# Altium project CommandBoard.PrjPcb
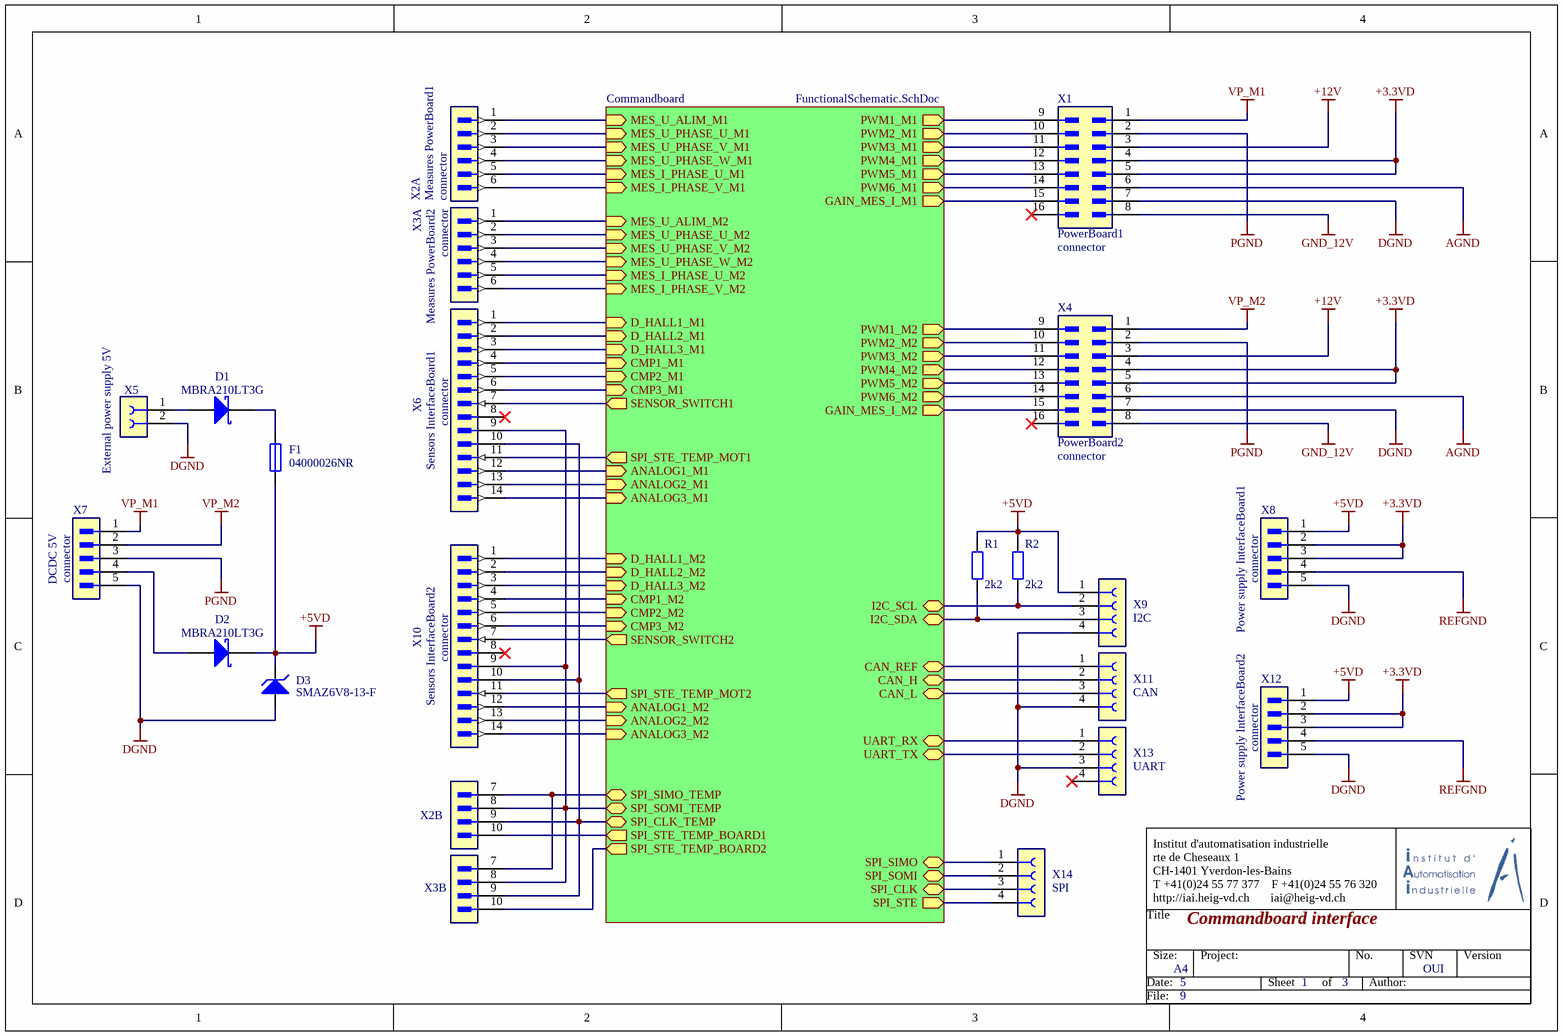
[diagram p0: CommandBoard.SchDoc]
ProjectAuthor: Bommottet Joan; ProjectiAiTitle: Driver Brushless; ProjectNumber: -; ProjectVersion: 1.0.0; ProjectVersionForDoc: 1_0_0
3 sheets, 127 parts. Net scope: hierarchical (ports join the sheet entries above them; power ports are global).
Board file: CommandBoard.PcbDoc
Sheets:
  CommandBoard.SchDoc
    Commandboard = FunctionalSchematic.SchDoc
      DSP = DSP.SchDoc

## Sheet CommandBoard.SchDoc: Commandboard interface
size A4; Author: Bommottet Joan; Organization: Institut d'Automatisation Industrielle; SheetNumber: 1; SheetTotal: 3; SVN: OUI; Version: 1.0.0; NoProject: -; ProjectTitle: Driver Brushless; CurrentTime: 6; CurrentDate: 5; DocumentFullPathAndName: 8; DocumentName: 9; ModifiedDate: 13; ProjectName: <projet>

### Parts
D1  value MBRA210LT3G  [DIOM4326X22N]  (hidden comment: DIODE SCHOTTKY 10V 2A SMA)
D2  value MBRA210LT3G  [DIOM4326X22N]  (hidden comment: DIODE SCHOTTKY 10V 2A SMA)
D3  value SMAZ6V8-13-F  [DIOM4326X22N]  (hidden comment: DIODE ZENER 6.8V 1W SMA)
F1  value 04000026NR  [FUSEC1508X06N]  (hidden comment: FUSE 1.5A 5V FAST 0603 SMD)
R1  value 2k2  [RESC1508X04N]  (hidden comment: RES SMD 2K2 0603)
R2  value 2k2  [RESC1508X04N]  (hidden comment: RES SMD 2K2 0603)
X1  Use: PowerBoard1  system: connector  [62101621021]  (hidden comment: CONNECT SMD 16pos 180°)
X2  Use: Measures PowerBoard1  system: connector  [62101021021]  (hidden comment: CONNECT SMD 10pos 180°)  (parts A,B of 2)
X3  Use: Measures PowerBoard2  system: connector  [62101021021]  (hidden comment: CONNECT SMD 10pos 180°)  (parts A,B of 2)
X4  Use: PowerBoard2  system: connector  [62101621021]  (hidden comment: CONNECT SMD 16pos 180°)
X5  Use: External power supply 5V  [WR-TBL322 3.81mm 2p]  (hidden comment: CONNECT 2pos 90°)
X6  Use: Sensors InterfaceBoard1  system: connector  [62101421021]  (hidden comment: CONNECT SMD 16pos 180°)
X7  Use: DCDC 5V  system: connector  [62000611121]  (hidden comment: CONNECT SMD 5pos 180°)
X8  Use: Power supply InterfaceBoard1  system: connector  [62000611121]  (hidden comment: CONNECT SMD 5pos 180°)
X9  Use: I2C  [TE_7-215079-4]  (hidden comment: CONNECT SMD 4pos 180°)
X10  Use: Sensors InterfaceBoard2  system: connector  [62101421021]  (hidden comment: CONNECT SMD 16pos 180°)
X11  Use: CAN  [TE_7-215079-4]  (hidden comment: CONNECT SMD 4pos 180°)
X12  Use: Power supply InterfaceBoard2  system: connector  [62000611121]  (hidden comment: CONNECT SMD 5pos 180°)
X13  Use: UART  [TE_7-215079-4]  (hidden comment: CONNECT SMD 4pos 180°)
X14  Use: SPI  [TE_7-215079-4]  (hidden comment: CONNECT SMD 4pos 180°)

### Sub-sheets
Commandboard = FunctionalSchematic.SchDoc: MES_I_PHASE_V_M1 (in), PWM4_M1 (out), MES_I_PHASE_U_M2 (in), ANALOG2_M2 (in), MES_U_PHASE_W_M1 (in), D_HALL3_M1 (in), PWM2_M1 (out), ANALOG2_M1 (in), UART_RX (bidir), PWM3_M1 (out), D_HALL2_M2 (in), SPI_SOMI (bidir), PWM4_M2 (out), PWM2_M2 (out), MES_U_ALIM_M1 (in), MES_I_PHASE_V_M2 (in), ANALOG3_M1 (in), D_HALL2_M1 (in), CAN_REF (bidir), MES_U_ALIM_M2 (in), PWM5_M2 (out), SPI_SIMO (bidir), PWM1_M2 (out), MES_I_PHASE_U_M1 (in), SPI_CLK (bidir), PWM3_M2 (out), PWM6_M2 (out), ANALOG1_M2 (in), PWM5_M1 (out), CAN_L (bidir), ANALOG3_M2 (in), I2C_SDA (bidir), PWM6_M1 (out), I2C_SCL (bidir), D_HALL3_M2 (in), PWM1_M1 (out), D_HALL1_M2 (in), UART_TX (bidir), CAN_H (bidir), ANALOG1_M1 (in), MES_U_PHASE_W_M2 (in), D_HALL1_M1 (in), SPI_SOMI_TEMP (bidir), SPI_CLK_TEMP (bidir), MES_U_PHASE_V_M1 (in), MES_U_PHASE_U_M1 (in), MES_U_PHASE_U_M2 (in), MES_U_PHASE_V_M2 (in), SPI_SIMO_TEMP (bidir), SENSOR_SWITCH1 (out), SENSOR_SWITCH2 (out), GAIN_MES_I_M1 (out), GAIN_MES_I_M2 (out), SPI_STE (out), CMP3_M1 (in), CMP1_M2 (in), SPI_STE_TEMP_BOARD1 (out), CMP1_M1 (in), SPI_STE_TEMP_MOT2 (out), SPI_STE_TEMP_MOT1 (out), CMP2_M1 (in), CMP3_M2 (in), CMP2_M2 (in), SPI_STE_TEMP_BOARD2 (out)

### Nets
+3.3VD: X1.4 X1.5 X4.4 X4.5 X8.2 X8.3 X12.2 X12.3
+5VD: D2.2(K) D3.2(K) F1.1 R1.2 R2.2 X8.1 X9.1 X12.1
+12V: X1.3 X4.3
AGND: X1.6 X4.6
DGND: D3.1(A) X1.7 X4.7 X5.2 X7.5 X8.5 X9.4 X11.4 X12.5 X13.3
GND_12V: X1.8 X4.8
PGND: X1.2 X4.2 X7.3
REFGND: X8.4 X12.4
VP_M1: X1.1 X7.1
VP_M2: X4.1 X7.2
NetD1_1: D1.1(A) X5.1
NetD1_2: D1.2(K) F1.2
NetD2_1: D2.1(A) X7.4
NetJP1_1: X11.2 ; sheet Commandboard/CAN_H
NetR1_1: R1.1 X9.3 ; sheet Commandboard/I2C_SDA
NetR2_1: R2.1 X9.2 ; sheet Commandboard/I2C_SCL
NetR9_1: X11.3 ; sheet Commandboard/CAN_L
NetR10_1: X2.1 ; sheet Commandboard/MES_U_ALIM_M1
NetR11_1: X2.4 ; sheet Commandboard/MES_U_PHASE_W_M1
NetR12_1: X6.12 ; sheet Commandboard/ANALOG1_M1
NetR13_1: X3.1 ; sheet Commandboard/MES_U_ALIM_M2
NetR14_1: X3.4 ; sheet Commandboard/MES_U_PHASE_W_M2
NetR15_1: X10.12 ; sheet Commandboard/ANALOG1_M2
NetR16_1: X2.2 ; sheet Commandboard/MES_U_PHASE_U_M1
NetR17_1: X2.5 ; sheet Commandboard/MES_I_PHASE_U_M1
NetR18_1: X6.13 ; sheet Commandboard/ANALOG2_M1
NetR19_1: X3.2 ; sheet Commandboard/MES_U_PHASE_U_M2
NetR20_1: X3.5 ; sheet Commandboard/MES_I_PHASE_U_M2
NetR21_1: X10.13 ; sheet Commandboard/ANALOG2_M2
NetR22_1: X2.3 ; sheet Commandboard/MES_U_PHASE_V_M1
NetR23_1: X2.6 ; sheet Commandboard/MES_I_PHASE_V_M1
NetR24_1: X6.14 ; sheet Commandboard/ANALOG3_M1
NetR25_1: X3.3 ; sheet Commandboard/MES_U_PHASE_V_M2
NetR26_1: X3.6 ; sheet Commandboard/MES_I_PHASE_V_M2
NetR27_1: X10.14 ; sheet Commandboard/ANALOG3_M2
NetU4_5: X11.1 ; sheet Commandboard/CAN_REF
NetU6_4: X1.9 ; sheet Commandboard/PWM1_M1
NetU6_5: X1.10 ; sheet Commandboard/PWM2_M1
NetU6_6: X1.11 ; sheet Commandboard/PWM3_M1
NetU6_7: X1.12 ; sheet Commandboard/PWM4_M1
NetU6_8: X1.13 ; sheet Commandboard/PWM5_M1
NetU6_9: X1.14 ; sheet Commandboard/PWM6_M1
NetU6_12: X6.1 ; sheet Commandboard/D_HALL1_M1
NetU6_13: X6.2 ; sheet Commandboard/D_HALL2_M1
NetU6_14: X6.3 ; sheet Commandboard/D_HALL3_M1
NetU6_22: X2.10 ; sheet Commandboard/SPI_STE_TEMP_BOARD1
NetU6_23: X6.11 ; sheet Commandboard/SPI_STE_TEMP_MOT1
NetU6_24: X3.10 ; sheet Commandboard/SPI_STE_TEMP_BOARD2
NetU6_25: X10.11 ; sheet Commandboard/SPI_STE_TEMP_MOT2
NetU6_63: X2.7 X3.7 ; sheet Commandboard/SPI_SIMO_TEMP
NetU6_64: X1.15 ; sheet Commandboard/GAIN_MES_I_M1
NetU6_65: X4.15 ; sheet Commandboard/GAIN_MES_I_M2
NetU6_97: X14.4 ; sheet Commandboard/SPI_STE
NetU6_101: X6.7 ; sheet Commandboard/SENSOR_SWITCH1
NetU6_102: X10.7 ; sheet Commandboard/SENSOR_SWITCH2
NetU6_108: X10.4 ; sheet Commandboard/CMP1_M2
NetU6_109: X10.5 ; sheet Commandboard/CMP2_M2
NetU6_111: X10.6 ; sheet Commandboard/CMP3_M2
NetU6_134: X14.1 ; sheet Commandboard/SPI_SIMO
NetU6_135: X14.2 ; sheet Commandboard/SPI_SOMI
NetU6_136: X14.3 ; sheet Commandboard/SPI_CLK
NetU6_141: X10.1 ; sheet Commandboard/D_HALL1_M2
NetU6_142: X10.2 ; sheet Commandboard/D_HALL2_M2
NetU6_143: X10.3 ; sheet Commandboard/D_HALL3_M2
NetU6_145: X6.4 ; sheet Commandboard/CMP1_M1
NetU6_146: X6.5 ; sheet Commandboard/CMP2_M1
NetU6_149: X6.6 ; sheet Commandboard/CMP3_M1
NetU6_154: X13.2 ; sheet Commandboard/UART_TX
NetU6_155: X13.1 ; sheet Commandboard/UART_RX
NetU6_160: X4.9 ; sheet Commandboard/PWM1_M2
NetU6_161: X4.10 ; sheet Commandboard/PWM2_M2
NetU6_162: X4.11 ; sheet Commandboard/PWM3_M2
NetU6_163: X4.12 ; sheet Commandboard/PWM4_M2
NetU6_164: X4.13 ; sheet Commandboard/PWM5_M2
NetU6_165: X4.14 ; sheet Commandboard/PWM6_M2
NetU6_174: X2.8 X3.8 X6.9 X10.9 ; sheet Commandboard/SPI_SOMI_TEMP
NetU6_175: X2.9 X3.9 X6.10 X10.10 ; sheet Commandboard/SPI_CLK_TEMP

Not connected (* = marked no-connect by the designer): X1 16*; X4 16*; X6 8*; X10 8*; X13 4*

### Notes on the sheet
- Title
- Institut d'automatisation industrielle
  rte de Cheseaux 1
  CH-1401 Yverdon-les-Bains
  T +41(0)24 55 77 377    F +41(0)24 55 76 320
  http://iai.heig-vd.ch       iai@heig-vd.ch
- Date:
- Size:
- A4
- Project:
- Sheet
- of
- No.
- Author:
- SVN
- Version
- File:

### Library data of the parts
D1 D2 = DIODE SCHOTTKY 10V 2A SMA: Diode Schottky 10V 2A Montage en surface SMA; ComponentLink1Description: Manufacturer Link; ComponentLink1URL: http://www.infineon.com/; ComponentLink2Description: Datasheet; ComponentLink2URL: http://www.infineon.com/upload/Document/cmc_upload/documents/009/363/bat17series.pdf; Supplier 1: Digi-Key; Supplier Part Number 1: MBRA210LT3GOSCT-ND
D3 = DIODE ZENER 6.8V 1W SMA: Diodes - Zener 6,8V 1W ±5% Montage en surface SMA; Supplier 1: Digi-Key; Supplier Part Number 1: SMAZ6V8-FDICT-ND
F1 = FUSE 1.5A 5V FAST 0603 SMD: 1,5A CA 5V Fusible CC Montage sur carte (type cartouche exclu) Montage en surface 0603 (1608 métrique); Supplier 1: Digi-Key; Supplier Part Number 1: F12132CT-ND
R1 R2 = RES SMD 2K2 OHM 1% 1/10W 0603: 2,2 kOhms ±1% 0,1W, 1/10W Pavé résistif 0603 (1608 métrique) AutomobileAEC-Q200 Couche épaisse; Supplier 1: Digi-Key; Supplier Part Number 1: RMCF0603FT2K20CT-ND
X1 X4 = CONNECT SMD 16pos 2row 180° 1.27mm: Value: *
X2 X3 = CONNECT SMD 10pos 180° 1.27mm: Value: *
X5 = CONNECT 2pos 90° 3.81mm F: 2 Positions, bloc de jonction Embase, broche mâle, gainée (4 côtés) 0,150 po (3,81mm) 90°, engle droit Trou traversant; Value: WR-TBL322; Supplier 1: Digi-Key; Supplier Part Number 1: 732-2088-ND
X6 X10 = CONNECT SMD 16pos 180° 1.27mm: Value: *
X7 X8 X12 = CONNECT SMD 5pos 180° 2mm: Value: *
X9 X11 X13 X14 = CONNECT SMD 4pos 180° 2.54mm F: Connecteur, embase Montage en surface 4 positions 0,100 po (2,54mm); Value: *

## Sheet FunctionalSchematic.SchDoc: DSP
size A3; Author: Bommottet Joan; Organization: Institut d'Automatisation Industrielle; SheetNumber: 2; SheetTotal: 3; SVN: OUI; Version: 1.0.0; NoProject: -; ProjectTitle: Driver Brushless; CurrentTime: 6; CurrentDate: 5; DocumentFullPathAndName: 8; DocumentName: 9; ModifiedDate: 13; ProjectName: <projet>
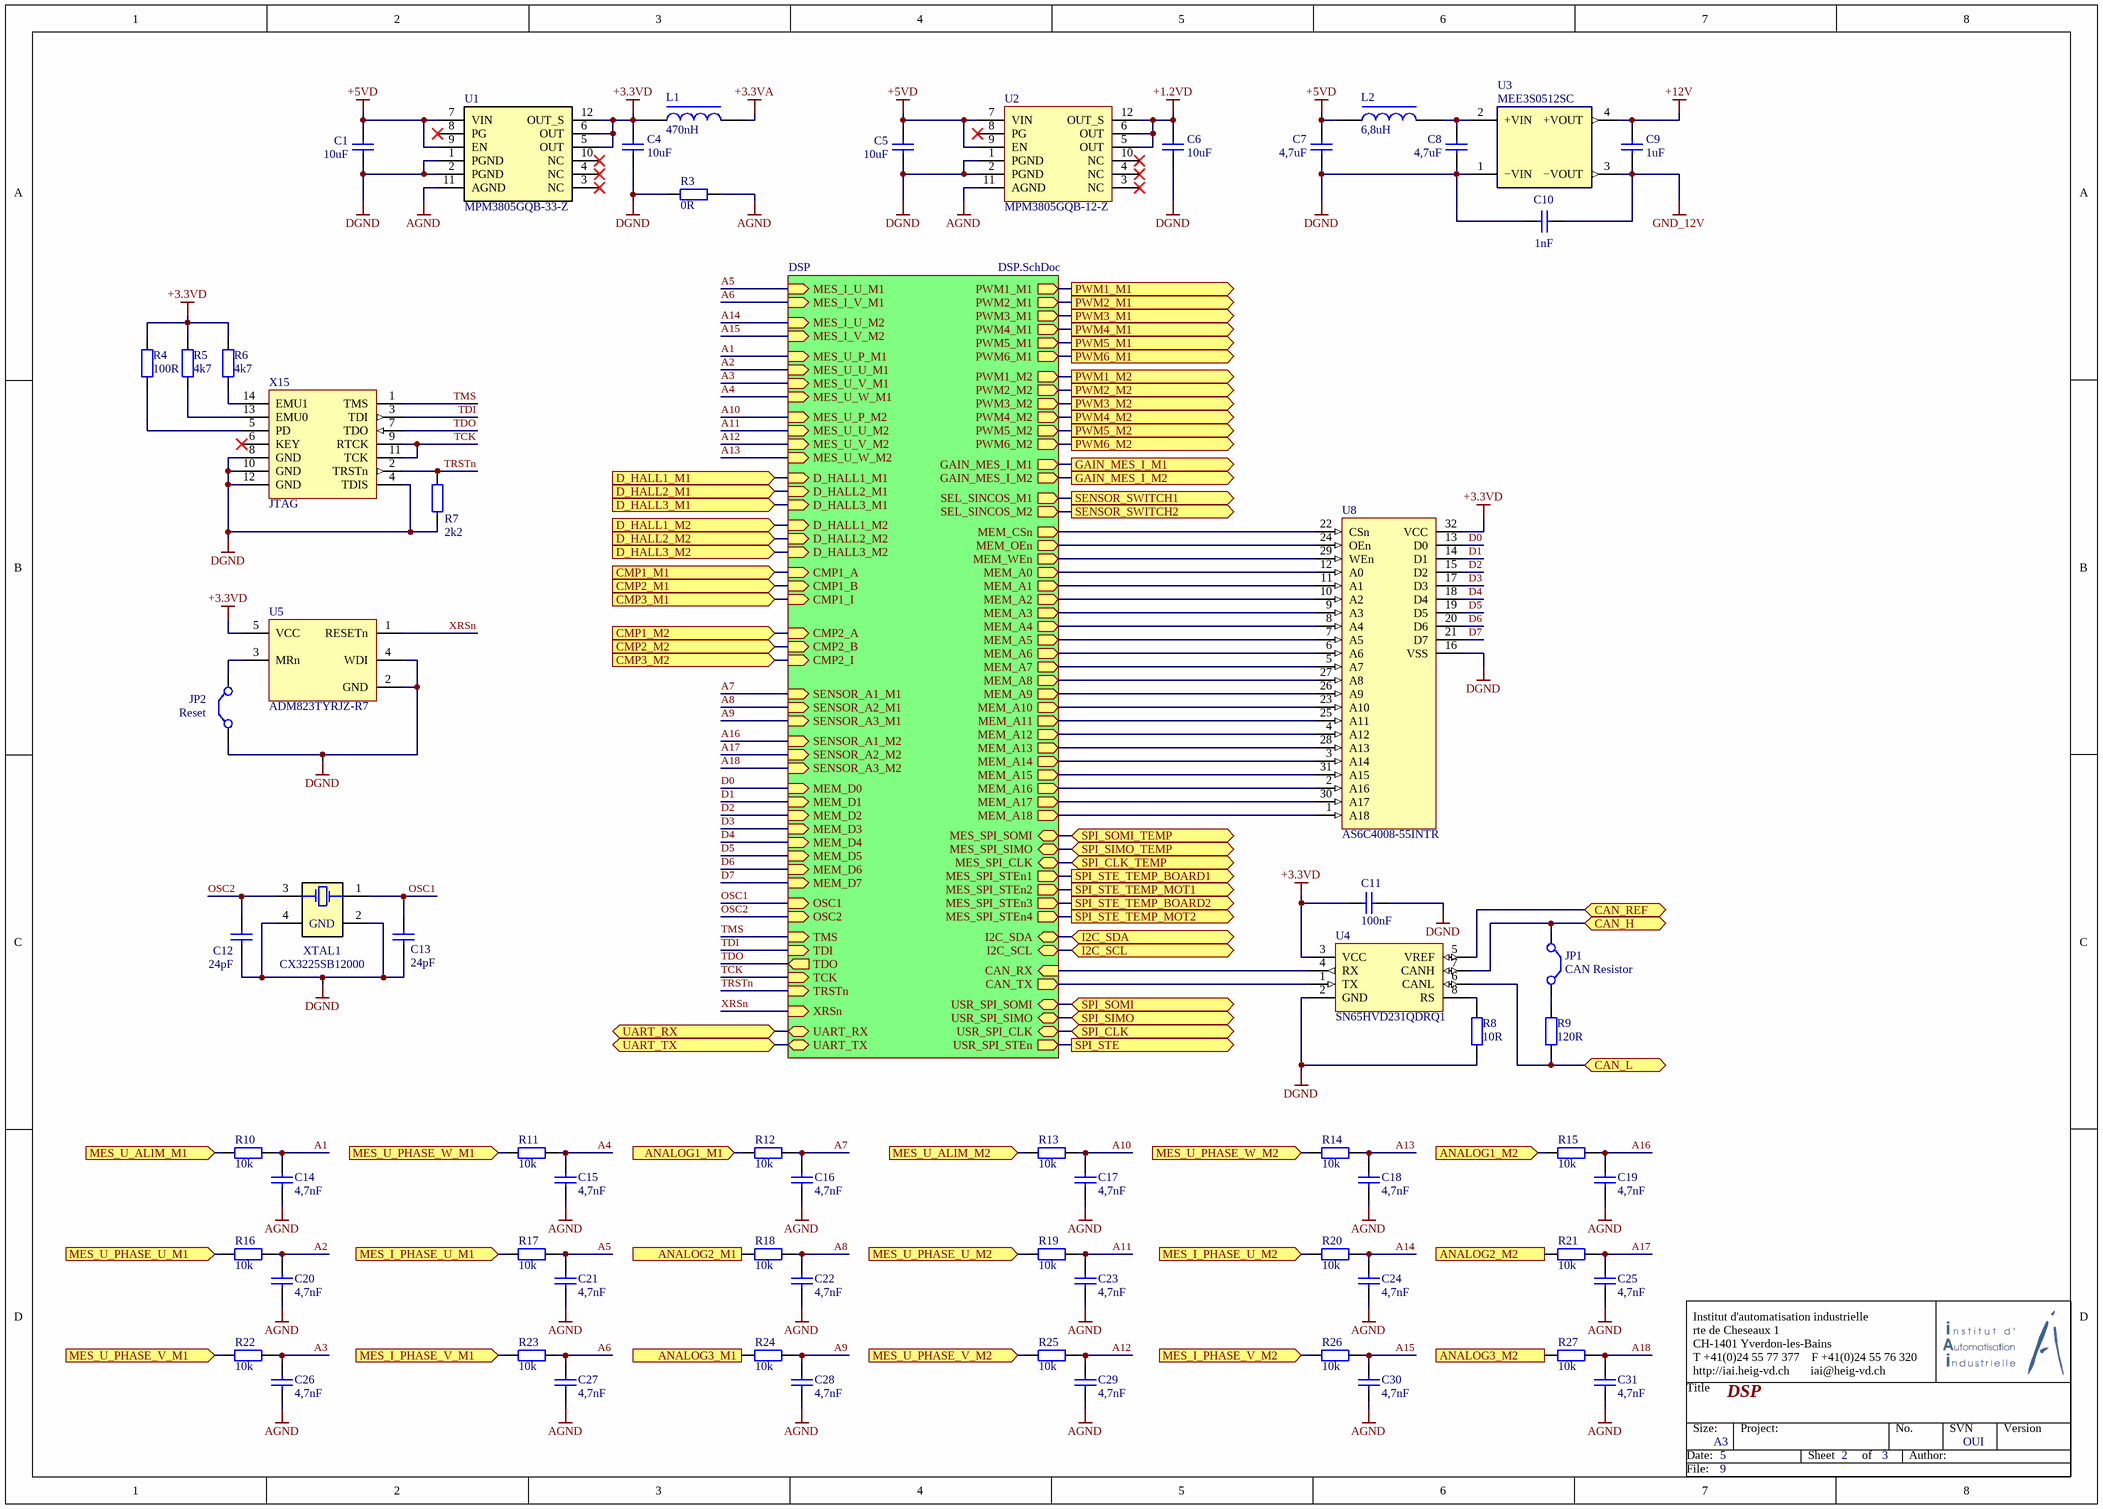
[diagram p1: FunctionalSchematic.SchDoc]

### Parts
C1  value 10uF  [CAPC1608X08N]  (hidden comment: CAP CER 10uF 0603)
C4  value 10uF  [CAPC1608X08N]  (hidden comment: CAP CER 10uF 0603)
C5  value 10uF  [CAPC1608X08N]  (hidden comment: CAP CER 10uF 0603)
C6  value 10uF  [CAPC1608X08N]  (hidden comment: CAP CER 10uF 0603)
C7  value 4,7uF  [CAPC1608X08N]  (hidden comment: CAP CER 4.7uF 0603)
C8  value 4,7uF  [CAPC1608X08N]  (hidden comment: CAP CER 4.7uF 0603)
C9  value 1uF  [CAPC1608X08N]  (hidden comment: CAP CER 1uF 0603)
C10  value 1nF  [CAPC1608X08N]  (hidden comment: CAP CER 1nF 0603)
C11  value 100nF  [CAPC1608X08N]  (hidden comment: CAP CER 100nF 0603)
C12  value 24pF  [CAPC1608X08N]  (hidden comment: CAP CER 1nF 0603)
C13  value 24pF  [CAPC1608X08N]  (hidden comment: CAP CER 1nF 0603)
C14  value 4,7nF  [CAPC1608X08N]  (hidden comment: CAP CER 4.7nF 0603)
C15  value 4,7nF  [CAPC1608X08N]  (hidden comment: CAP CER 4.7nF 0603)
C16  value 4,7nF  [CAPC1608X08N]  (hidden comment: CAP CER 4.7nF 0603)
C17  value 4,7nF  [CAPC1608X08N]  (hidden comment: CAP CER 4.7nF 0603)
C18  value 4,7nF  [CAPC1608X08N]  (hidden comment: CAP CER 4.7nF 0603)
C19  value 4,7nF  [CAPC1608X08N]  (hidden comment: CAP CER 4.7nF 0603)
C20  value 4,7nF  [CAPC1608X08N]  (hidden comment: CAP CER 4.7nF 0603)
C21  value 4,7nF  [CAPC1608X08N]  (hidden comment: CAP CER 4.7nF 0603)
C22  value 4,7nF  [CAPC1608X08N]  (hidden comment: CAP CER 4.7nF 0603)
C23  value 4,7nF  [CAPC1608X08N]  (hidden comment: CAP CER 4.7nF 0603)
C24  value 4,7nF  [CAPC1608X08N]  (hidden comment: CAP CER 4.7nF 0603)
C25  value 4,7nF  [CAPC1608X08N]  (hidden comment: CAP CER 4.7nF 0603)
C26  value 4,7nF  [CAPC1608X08N]  (hidden comment: CAP CER 4.7nF 0603)
C27  value 4,7nF  [CAPC1608X08N]  (hidden comment: CAP CER 4.7nF 0603)
C28  value 4,7nF  [CAPC1608X08N]  (hidden comment: CAP CER 4.7nF 0603)
C29  value 4,7nF  [CAPC1608X08N]  (hidden comment: CAP CER 4.7nF 0603)
C30  value 4,7nF  [CAPC1608X08N]  (hidden comment: CAP CER 4.7nF 0603)
C31  value 4,7nF  [CAPC1608X08N]  (hidden comment: CAP CER 4.7nF 0603)
JP1  Use: CAN Resistor  [62000211121]  (hidden comment: CONNECT 2pos 90°)
JP2  Use: Reset  [62000211121]  (hidden comment: CONNECT 2pos 90°)
L1  value 470nH  [INDC2016X10N]  (hidden comment: IND SMD 470nH 0806)
L2  value 6,8uH  [INDC1608X10N]  (hidden comment: IND SMD 0603)
R3  value 0R  [RESC1508X04N]  (hidden comment: RES SMD 0R 0603)
R4  value 100R  [RESC1508X04N]  (hidden comment: RES SMD 100R 0603)
R5  value 4k7  [RESC1508X04N]  (hidden comment: RES SMD 4.7k 0603)
R6  value 4k7  [RESC1508X04N]  (hidden comment: RES SMD 4.7k 0603)
R7  value 2k2  [RESC1508X04N]  (hidden comment: RES SMD 2K2 0603)
R8  value 10R  [RESC1508X04N]  (hidden comment: RES SMD 10R 0603)
R9  value 120R  [RESC1508X04N]  (hidden comment: RES SMD 120R 0603)
R10  value 10k  [RESC1508X04N]  (hidden comment: RES 10K SMD 0603)
R11  value 10k  [RESC1508X04N]  (hidden comment: RES 10K SMD 0603)
R12  value 10k  [RESC1508X04N]  (hidden comment: RES 10K SMD 0603)
R13  value 10k  [RESC1508X04N]  (hidden comment: RES 10K SMD 0603)
R14  value 10k  [RESC1508X04N]  (hidden comment: RES 10K SMD 0603)
R15  value 10k  [RESC1508X04N]  (hidden comment: RES 10K SMD 0603)
R16  value 10k  [RESC1508X04N]  (hidden comment: RES 10K SMD 0603)
R17  value 10k  [RESC1508X04N]  (hidden comment: RES 10K SMD 0603)
R18  value 10k  [RESC1508X04N]  (hidden comment: RES 10K SMD 0603)
R19  value 10k  [RESC1508X04N]  (hidden comment: RES 10K SMD 0603)
R20  value 10k  [RESC1508X04N]  (hidden comment: RES 10K SMD 0603)
R21  value 10k  [RESC1508X04N]  (hidden comment: RES 10K SMD 0603)
R22  value 10k  [RESC1508X04N]  (hidden comment: RES 10K SMD 0603)
R23  value 10k  [RESC1508X04N]  (hidden comment: RES 10K SMD 0603)
R24  value 10k  [RESC1508X04N]  (hidden comment: RES 10K SMD 0603)
R25  value 10k  [RESC1508X04N]  (hidden comment: RES 10K SMD 0603)
R26  value 10k  [RESC1508X04N]  (hidden comment: RES 10K SMD 0603)
R27  value 10k  [RESC1508X04N]  (hidden comment: RES 10K SMD 0603)
U1  value MPM3805GQB-33-Z  [QFN2p5x3p0x0p9_MNP]  (hidden comment: DC DC CONVERTER 5V-3.3V)
U2  value MPM3805GQB-12-Z  [QFN2p5x3p0x0p9_MNP]  (hidden comment: DC DC CONVERTER 5V-1.2V)
U3  value MEE3S0512SC  [DCDC CONVERTER]  (hidden comment: DC DC CONVERTER 5V-12V)
U4  value SN65HVD231QDRQ1  [SOIC127P600X175-8N]  (hidden comment: IC TRANSCEIVER CAN)
U5  value ADM823TYRJZ-R7  [SOT95P280X145-5N]  (hidden comment: SUPERVISOR 1 CHANNEL)
U8  value AS6C4008-55INTR  [SOP127P1410X300-32N]  (hidden comment: RAM SPI)
X15  Use: JTAG  [62101421021]  (hidden comment: CONNECT SMD 7x2pos 180°)
XTAL1  value CX3225SB12000  [OSCCC320X250X60N]  (hidden comment: CRYSTAL 12.0000MHZ)

### Sub-sheets
DSP = DSP.SchDoc: MEM_A11 (out), MES_U_U_M2 (in), MEM_A18 (out), SEL_SINCOS_M2 (out), MES_U_P_M2 (in), MEM_D1 (in), SENSOR_A3_M1 (in), D_HALL3_M1 (in), D_HALL3_M2 (in), MES_SPI_STEn1 (out), SENSOR_A3_M2 (in), MES_SPI_STEn3 (out), MES_I_U_M2 (in), MEM_D0 (in), CMP1_I (in), MEM_D4 (in), CMP2_I (in), MES_SPI_STEn2 (out), CMP2_B (in), MEM_D5 (in), MEM_D6 (in), MES_SPI_STEn4 (out), MEM_A15 (out), CMP1_A (in), MES_I_V_M1 (in), MEM_D2 (in), OSC2 (in), TDI (in), SEL_SINCOS_M1 (out), MES_U_P_M1 (in), SENSOR_A2_M1 (in), XRSn (in), SENSOR_A1_M1 (in), SENSOR_A2_M2 (in), MEM_D7 (in), MES_U_V_M2 (in), D_HALL2_M2 (in), MEM_A16 (out), OSC1 (in), MES_I_V_M2 (in), MEM_A7 (out), MEM_A14 (out), MEM_D3 (in), MEM_A10 (out), MEM_A9 (out), TMS (in), MES_U_V_M1 (in), GAIN_MES_I_M1 (out), MEM_A12 (out), TRSTn (in), D_HALL1_M1 (in), MEM_A6 (out), MEM_A17 (out), CMP1_B (in), MES_U_W_M1 (in), SENSOR_A1_M2 (in), MES_U_U_M1 (in), D_HALL2_M1 (in), TCK (in), D_HALL1_M2 (in), MES_U_W_M2 (in), MEM_A13 (out), TDO (out), MES_I_U_M1 (in), MEM_CSn (out), MEM_A8 (out), CMP2_A (in), GAIN_MES_I_M2 (out), MEM_A2 (out), PWM5_M1 (out), MEM_A0 (out), PWM6_M1 (out), MEM_OEn (out), MES_SPI_CLK (bidir), USR_SPI_CLK (bidir), PWM2_M1 (out), PWM5_M2 (out), UART_TX (bidir), MES_SPI_SOMI (bidir), PWM6_M2 (out), PWM1_M2 (out), USR_SPI_SIMO (bidir), PWM3_M1 (out), I2C_SCL (bidir), USR_SPI_SOMI (bidir), MEM_A5 (out), PWM3_M2 (out), I2C_SDA (bidir), MEM_A4 (out), MEM_WEn (out), UART_RX (bidir), PWM4_M2 (out), CAN_RX (in), USR_SPI_STEn (out), CAN_TX (out), PWM4_M1 (out), PWM1_M1 (out), MES_SPI_SIMO (bidir), MEM_A3 (out), MEM_A1 (out), PWM2_M2 (out)

### Ports
ANALOG1_M1 (in), ANALOG1_M2 (in), ANALOG2_M1 (in), ANALOG2_M2 (in), ANALOG3_M1 (in), ANALOG3_M2 (in), CAN_H (bidir), CAN_L (bidir), CAN_REF (bidir), CMP1_M1 (in), CMP1_M2 (in), CMP2_M1 (in), CMP2_M2 (in), CMP3_M1 (in), CMP3_M2 (in), D_HALL1_M1 (in), D_HALL1_M2 (in), D_HALL2_M1 (in), D_HALL2_M2 (in), D_HALL3_M1 (in), D_HALL3_M2 (in), GAIN_MES_I_M1 (out), GAIN_MES_I_M2 (out), I2C_SCL (bidir), I2C_SDA (bidir), MES_I_PHASE_U_M1 (in), MES_I_PHASE_U_M2 (in), MES_I_PHASE_V_M1 (in), MES_I_PHASE_V_M2 (in), MES_U_ALIM_M1 (in), MES_U_ALIM_M2 (in), MES_U_PHASE_U_M1 (in), MES_U_PHASE_U_M2 (in), MES_U_PHASE_V_M1 (in), MES_U_PHASE_V_M2 (in), MES_U_PHASE_W_M1 (in), MES_U_PHASE_W_M2 (in), PWM1_M1 (out), PWM1_M2 (out), PWM2_M1 (out), PWM2_M2 (out), PWM3_M1 (out), PWM3_M2 (out), PWM4_M1 (out), PWM4_M2 (out), PWM5_M1 (out), PWM5_M2 (out), PWM6_M1 (out), PWM6_M2 (out), SENSOR_SWITCH1 (out), SENSOR_SWITCH2 (out), SPI_CLK (bidir), SPI_CLK_TEMP (bidir), SPI_SIMO (bidir), SPI_SIMO_TEMP (bidir), SPI_SOMI (bidir), SPI_SOMI_TEMP (bidir), SPI_STE (out), SPI_STE_TEMP_BOARD1 (out), SPI_STE_TEMP_BOARD2 (out), SPI_STE_TEMP_MOT1 (out), SPI_STE_TEMP_MOT2 (out), UART_RX (bidir), UART_TX (bidir)

### Nets
+1.2VD: C6.2 U2.5(OUT) U2.6(OUT) U2.12(OUT_S)
+3.3VA: L1.2
+3.3VD: C4.2 C11.1 L1.1 R4.2 R5.2 R6.2 U1.5(OUT) U1.6(OUT) U1.12(OUT_S) U4.3(VCC) U5.5(VCC) U8.32(VCC)
+5VD: C1.2 C5.2 C7.2 L2.1 U1.7(VIN) U1.9(EN) U2.7(VIN) U2.9(EN)
+12V: C9.2 U3.4(+VOUT)
AGND: C14.1 C15.1 C16.1 C17.1 C18.1 C19.1 C20.1 C21.1 C22.1 C23.1 C24.1 C25.1 C26.1 C27.1 C28.1 C29.1 C30.1 C31.1 R3.2 U1.11(AGND) U2.11(AGND)
DGND: C1.1 C4.1 C5.1 C6.1 C7.1 C8.1 C10.1 C11.2 C12.1 C13.2 JP2.2(C2) R3.1 R7.1 R8.1 U1.1(PGND) U1.2(PGND) U2.1(PGND) U2.2(PGND) U3.1(−VIN) U4.2(GND) U5.2(GND) U5.4(WDI) U8.16(VSS) X15.4(TDIS) X15.8(GND) X15.10(GND) X15.12(GND) XTAL1.2(GND) XTAL1.4(GND)
GND_12V: C9.1 C10.2 U3.3(−VOUT)
A1: C14.2 R10.2 ; sheet DSP/MES_U_P_M1
A2: C20.2 R16.2 ; sheet DSP/MES_U_U_M1
A3: C26.2 R22.2 ; sheet DSP/MES_U_V_M1
A4: C15.2 R11.2 ; sheet DSP/MES_U_W_M1
A5: C21.2 R17.2 ; sheet DSP/MES_I_U_M1
A6: C27.2 R23.2 ; sheet DSP/MES_I_V_M1
A7: C16.2 R12.2 ; sheet DSP/SENSOR_A1_M1
A8: C22.2 R18.2 ; sheet DSP/SENSOR_A2_M1
A9: C28.2 R24.2 ; sheet DSP/SENSOR_A3_M1
A10: C17.2 R13.2 ; sheet DSP/MES_U_P_M2
A11: C23.2 R19.2 ; sheet DSP/MES_U_U_M2
A12: C29.2 R25.2 ; sheet DSP/MES_U_V_M2
A13: C18.2 R14.2 ; sheet DSP/MES_U_W_M2
A14: C24.2 R20.2 ; sheet DSP/MES_I_U_M2
A15: C30.2 R26.2 ; sheet DSP/MES_I_V_M2
A16: C19.2 R15.2 ; sheet DSP/SENSOR_A1_M2
A17: C25.2 R21.2 ; sheet DSP/SENSOR_A2_M2
A18: C31.2 R27.2 ; sheet DSP/SENSOR_A3_M2
D0: U8.13(D0) ; sheet DSP/MEM_D0
D1: U8.14(D1) ; sheet DSP/MEM_D1
D2: U8.15(D2) ; sheet DSP/MEM_D2
D3: U8.17(D3) ; sheet DSP/MEM_D3
D4: U8.18(D4) ; sheet DSP/MEM_D4
D5: U8.19(D5) ; sheet DSP/MEM_D5
D6: U8.20(D6) ; sheet DSP/MEM_D6
D7: U8.21(D7) ; sheet DSP/MEM_D7
OSC1: C13.1 XTAL1.1(OSC1) ; sheet DSP/OSC1
OSC2: C12.2 XTAL1.3(OSC2) ; sheet DSP/OSC2
TCK: X15.9(RTCK) X15.11(TCK) ; sheet DSP/TCK
TDI: X15.3(TDI) ; sheet DSP/TDI
TDO: X15.7(TDO) ; sheet DSP/TDO
TMS: X15.1(TMS) ; sheet DSP/TMS
TRSTn: R7.2 X15.2(TRSTn) ; sheet DSP/TRSTn
XRSn: U5.1(RESETn) ; sheet DSP/XRSn
NetC8_2: C8.2 L2.2 U3.2(+VIN)
NetJP1_1: JP1.1(C1) U4.7(CANH) ; port CAN_H
NetJP1_2: JP1.2(C2) R9.2
NetJP2_1: JP2.1(C1) U5.3(MRn)
NetR1_1: port I2C_SDA, sheet DSP/I2C_SDA
NetR2_1: port I2C_SCL, sheet DSP/I2C_SCL
NetR4_1: R4.1 X15.5(PD)
NetR5_1: R5.1 X15.13(EMU0)
NetR6_1: R6.1 X15.14(EMU1)
NetR8_2: R8.2 U4.8(RS)
NetR9_1: R9.1 U4.6(CANL) ; port CAN_L
NetR10_1: R10.1 ; port MES_U_ALIM_M1
NetR11_1: R11.1 ; port MES_U_PHASE_W_M1
NetR12_1: R12.1 ; port ANALOG1_M1
NetR13_1: R13.1 ; port MES_U_ALIM_M2
NetR14_1: R14.1 ; port MES_U_PHASE_W_M2
NetR15_1: R15.1 ; port ANALOG1_M2
NetR16_1: R16.1 ; port MES_U_PHASE_U_M1
NetR17_1: R17.1 ; port MES_I_PHASE_U_M1
NetR18_1: R18.1 ; port ANALOG2_M1
NetR19_1: R19.1 ; port MES_U_PHASE_U_M2
NetR20_1: R20.1 ; port MES_I_PHASE_U_M2
NetR21_1: R21.1 ; port ANALOG2_M2
NetR22_1: R22.1 ; port MES_U_PHASE_V_M1
NetR23_1: R23.1 ; port MES_I_PHASE_V_M1
NetR24_1: R24.1 ; port ANALOG3_M1
NetR25_1: R25.1 ; port MES_U_PHASE_V_M2
NetR26_1: R26.1 ; port MES_I_PHASE_V_M2
NetR27_1: R27.1 ; port ANALOG3_M2
NetU4_1: U4.1(TX) ; sheet DSP/CAN_TX
NetU4_4: U4.4(RX) ; sheet DSP/CAN_RX
NetU4_5: U4.5(VREF) ; port CAN_REF
NetU6_4: port PWM1_M1, sheet DSP/PWM1_M1
NetU6_5: port PWM2_M1, sheet DSP/PWM2_M1
NetU6_6: port PWM3_M1, sheet DSP/PWM3_M1
NetU6_7: port PWM4_M1, sheet DSP/PWM4_M1
NetU6_8: port PWM5_M1, sheet DSP/PWM5_M1
NetU6_9: port PWM6_M1, sheet DSP/PWM6_M1
NetU6_12: port D_HALL1_M1, sheet DSP/D_HALL1_M1
NetU6_13: port D_HALL2_M1, sheet DSP/D_HALL2_M1
NetU6_14: port D_HALL3_M1, sheet DSP/D_HALL3_M1
NetU6_22: port SPI_STE_TEMP_BOARD1, sheet DSP/MES_SPI_STEn1
NetU6_23: port SPI_STE_TEMP_MOT1, sheet DSP/MES_SPI_STEn2
NetU6_24: port SPI_STE_TEMP_BOARD2, sheet DSP/MES_SPI_STEn3
NetU6_25: port SPI_STE_TEMP_MOT2, sheet DSP/MES_SPI_STEn4
NetU6_63: port SPI_SIMO_TEMP, sheet DSP/MES_SPI_SIMO
NetU6_64: port GAIN_MES_I_M1, sheet DSP/GAIN_MES_I_M1
NetU6_65: port GAIN_MES_I_M2, sheet DSP/GAIN_MES_I_M2
NetU6_66: U8.29(WEn) ; sheet DSP/MEM_WEn
NetU6_67: U8.22(CSn) ; sheet DSP/MEM_CSn
NetU6_83: U8.11(A1) ; sheet DSP/MEM_A1
NetU6_84: U8.24(OEn) ; sheet DSP/MEM_OEn
NetU6_85: U8.12(A0) ; sheet DSP/MEM_A0
NetU6_87: U8.10(A2) ; sheet DSP/MEM_A2
NetU6_89: U8.9(A3) ; sheet DSP/MEM_A3
NetU6_90: U8.27(A8) ; sheet DSP/MEM_A8
NetU6_93: U8.26(A9) ; sheet DSP/MEM_A9
NetU6_94: U8.23(A10) ; sheet DSP/MEM_A10
NetU6_95: U8.25(A11) ; sheet DSP/MEM_A11
NetU6_96: U8.4(A12) ; sheet DSP/MEM_A12
NetU6_97: port SPI_STE, sheet DSP/USR_SPI_STEn
NetU6_101: port SENSOR_SWITCH1, sheet DSP/SEL_SINCOS_M1
NetU6_102: port SENSOR_SWITCH2, sheet DSP/SEL_SINCOS_M2
NetU6_108: port CMP1_M2, sheet DSP/CMP2_A
NetU6_109: port CMP2_M2, sheet DSP/CMP2_B
NetU6_111: port CMP3_M2, sheet DSP/CMP2_I
NetU6_113: U8.8(A4) ; sheet DSP/MEM_A4
NetU6_115: U8.7(A5) ; sheet DSP/MEM_A5
NetU6_128: U8.6(A6) ; sheet DSP/MEM_A6
NetU6_129: U8.5(A7) ; sheet DSP/MEM_A7
NetU6_134: port SPI_SIMO, sheet DSP/USR_SPI_SIMO
NetU6_135: port SPI_SOMI, sheet DSP/USR_SPI_SOMI
NetU6_136: port SPI_CLK, sheet DSP/USR_SPI_CLK
NetU6_141: port D_HALL1_M2, sheet DSP/D_HALL1_M2
NetU6_142: port D_HALL2_M2, sheet DSP/D_HALL2_M2
NetU6_143: port D_HALL3_M2, sheet DSP/D_HALL3_M2
NetU6_145: port CMP1_M1, sheet DSP/CMP1_A
NetU6_146: port CMP2_M1, sheet DSP/CMP1_B
NetU6_149: port CMP3_M1, sheet DSP/CMP1_I
NetU6_154: port UART_TX, sheet DSP/UART_TX
NetU6_155: port UART_RX, sheet DSP/UART_RX
NetU6_156: U8.28(A13) ; sheet DSP/MEM_A13
NetU6_157: U8.3(A14) ; sheet DSP/MEM_A14
NetU6_160: port PWM1_M2, sheet DSP/PWM1_M2
NetU6_161: port PWM2_M2, sheet DSP/PWM2_M2
NetU6_162: port PWM3_M2, sheet DSP/PWM3_M2
NetU6_163: port PWM4_M2, sheet DSP/PWM4_M2
NetU6_164: port PWM5_M2, sheet DSP/PWM5_M2
NetU6_165: port PWM6_M2, sheet DSP/PWM6_M2
NetU6_170: U8.31(A15) ; sheet DSP/MEM_A15
NetU6_171: U8.2(A16) ; sheet DSP/MEM_A16
NetU6_172: U8.30(A17) ; sheet DSP/MEM_A17
NetU6_173: U8.1(A18) ; sheet DSP/MEM_A18
NetU6_174: port SPI_SOMI_TEMP, sheet DSP/MES_SPI_SOMI
NetU6_175: port SPI_CLK_TEMP, sheet DSP/MES_SPI_CLK

Not connected (* = marked no-connect by the designer): U1 3(NC)* 4(NC)* 8(PG)* 10(NC)*; U2 3(NC)* 4(NC)* 8(PG)* 10(NC)*; X15 6(KEY)*

### Notes on the sheet
- Title
- Institut d'automatisation industrielle
  rte de Cheseaux 1
  CH-1401 Yverdon-les-Bains
  T +41(0)24 55 77 377    F +41(0)24 55 76 320
  http://iai.heig-vd.ch       iai@heig-vd.ch
- Date:
- Size:
- A3
- Project:
- Sheet
- of
- No.
- Author:
- SVN
- Version
- File:

### Library data of the parts
C1 C4-C6 = CAP CER 10uF 10% 10V 0603: 10µF ±20% 10V Condensateurs céramique X5R 0603 (1608 métrique); Supplier 1: Digi-Key; Supplier Part Number 1: 399-14945-1-ND
C7 C8 = CAP CER 4.7uF 10% 10V 0603: 4,7µF ±20% 10V Condensateurs céramique X5R 0603 (1608 métrique); Supplier 1: Digi-Key; Supplier Part Number 1: 399-9100-1-ND
C9 = CAP CER 1uF 10% 16V 0603: 1µF ±10% 16V Condensateurs céramique X7R 0603 (1608 métrique); Supplier 1: Digi-Key; Supplier Part Number 1: 399-7847-1-ND
C10 = CAP CER 1nF 10% 10V 0603: 1nF ±10% 10V Condensateurs céramique X7R 0603 (1608 métrique); Supplier 1: Digi-Key; Supplier Part Number 1: 399-8984-1-ND
C11 = CAP CER 100nF 10% 10V 0603: 0,1µF ±10% 10V Condensateurs céramique X7R 0603 (1608 métrique); Supplier 1: Digi-Key; Supplier Part Number 1: 399-1095-1-ND
C12 C13 = CAP CER 24pF 10% 10V 0603: 24pF ±10% 10V Condensateurs céramique X7R 0603 (1608 métrique); Supplier 1: Digi-Key; Supplier Part Number 1: 399-8984-1-ND
C14-C31 = CAP CER 4.7nF 10% 10V 0603: 4,7nF ±10% 10V Condensateurs céramique X7R 0603 (1608 métrique); Supplier 1: Digi-Key; Supplier Part Number 1: 399-9092-1-ND
JP1 JP2 = CONNECT 2pos 90° 3.81mm: 2 Positions, bloc de jonction Embase, broche mâle, gainée (4 côtés) 0,150 po (3,81mm) 90°, engle droit Trou traversant; Value: WR-TBL322; Supplier 1: Digi-Key; Supplier Part Number 1: 732-2088-ND
L2 = IND SMD 6.8uH 0603: 6,8µH Blindé Multicouche Inducteur 15mA 1,3Ohms maxi 0603 (1608 métrique); Supplier 1: Digi-Key; Supplier Part Number 1: 445-173923-1-ND
R3 = RES SMD 0 OHM 1% 1/10W 0603: Resistance 0 OHM
R4 = RES SMD 100 OHM 1% 1/10W 0603: 100 Ohms ±1% 0,1W, 1/10W Pavé résistif 0603 (1608 métrique) AutomobileAEC-Q200 Couche épaisse; Supplier 1: Digi-Key; Supplier Part Number 1: RMCF0603FT100RCT-ND
R5 R6 = RES SMD 4.7k OHM 1% 1/10W 0603: 4,7 kOhms ±1% 0,1W, 1/10W Pavé résistif 0603 (1608 métrique) AutomobileAEC-Q200 Couche épaisse; Supplier 1: Digi-Key; Supplier Part Number 1: RMCF0603FT4K70CT-ND
R7 = RES SMD 2K2 OHM 1% 1/10W 0603: as R1 on sheet CommandBoard; Supplier 1: Digi-Key; Supplier Part Number 1: RMCF0603FT2K20CT-ND
R8 = RES SMD 10 OHM 1% 1/10W 0603: 10 Ohms ±1% 0,1W, 1/10W Pavé résistif 0603 (1608 métrique) AutomobileAEC-Q200 Couche épaisse; Supplier 1: Digi-Key; Supplier Part Number 1: RMCF0603FT10R0CT-ND
R9 = RES SMD 120 OHM 1% 1/10W 0603: 120 Ohms ±1% 0,1W, 1/10W Pavé résistif 0603 (1608 métrique) AutomobileAEC-Q200 Couche épaisse; Supplier 1: Digi-Key; Supplier Part Number 1: RMCF0603FT120RCT-ND
R10-R27 = RES SMD 10K OHM 1% 1/10W 0603: 10 kOhms ±1% 0,1W, 1/10W Pavé résistif 0603 (1608 métrique) AutomobileAEC-Q200 Couche épaisse; Supplier 1: Digi-Key; Supplier Part Number 1: RMCF0603FT10K0CT-ND
U1 = DC DC CONVERTER 5V-3.3V 2W: Module PoL non isolé Convertisseurs CC/CC 1 Sortie 3,3V 600mA 2,5V - 6V Entrée; Supplier 1: Digi-Key; Supplier Part Number 1: 1589-1986-1-ND
U2 = DC DC CONVERTER 5V-1.2V 720mW: Module PoL non isolé Convertisseurs CC/CC 1 Sortie 1,2V 600mA 2,5V - 6V Entrée /; Supplier 1: Digi-Key; Supplier Part Number 1: 1589-1983-1-ND
U3 = DC DC CONVERTER 5V-12V 3W: Module isolé Convertisseurs CC/CC 1 Sortie 12V 250mA 4,5V - 5,5V Entrée; Supplier 1: Digi-Key; Supplier Part Number 1: 811-2358-5-ND
U4 = IC TRANSCEIVER HALF 1/1 8SOIC: Émetteur-récepteur 1/1 Semi CANbus 8-SOIC; Supplier 1: Digi-Key; Supplier Part Number 1: 296-15380-1-ND
U5 = IC SUPERVISOR 1 CHANNEL SOT23-5: Superviseur Pousser-tirer/Totem pôle 1 canal SOT-23-5; Supplier 1: Digi-Key; Supplier Part Number 1: ADM823TYRJZ-R7CT-ND
U8 = RAM: IC RAM 8MBIT SPI 10MHZ 8SOP
X15 = CONNECT SMD 7x2pos 180° 2.54mm: Value: *
XTAL1 = OSCILLATOR 12MHz: CRYSTAL 12.0000MHZ 8PF SMD

## Sheet DSP.SchDoc: <title>
size A4; Author: Bommottet Joan; Organization: Institut d'Automatisation Industrielle; SheetNumber: 3; SheetTotal: 3; SVN: OUI; Version: 1.0.0; NoProject: -; ProjectTitle: Driver Brushless; CurrentTime: 6; CurrentDate: 5; DocumentFullPathAndName: 8; DocumentName: 9; ModifiedDate: 13; ProjectName: <projet>
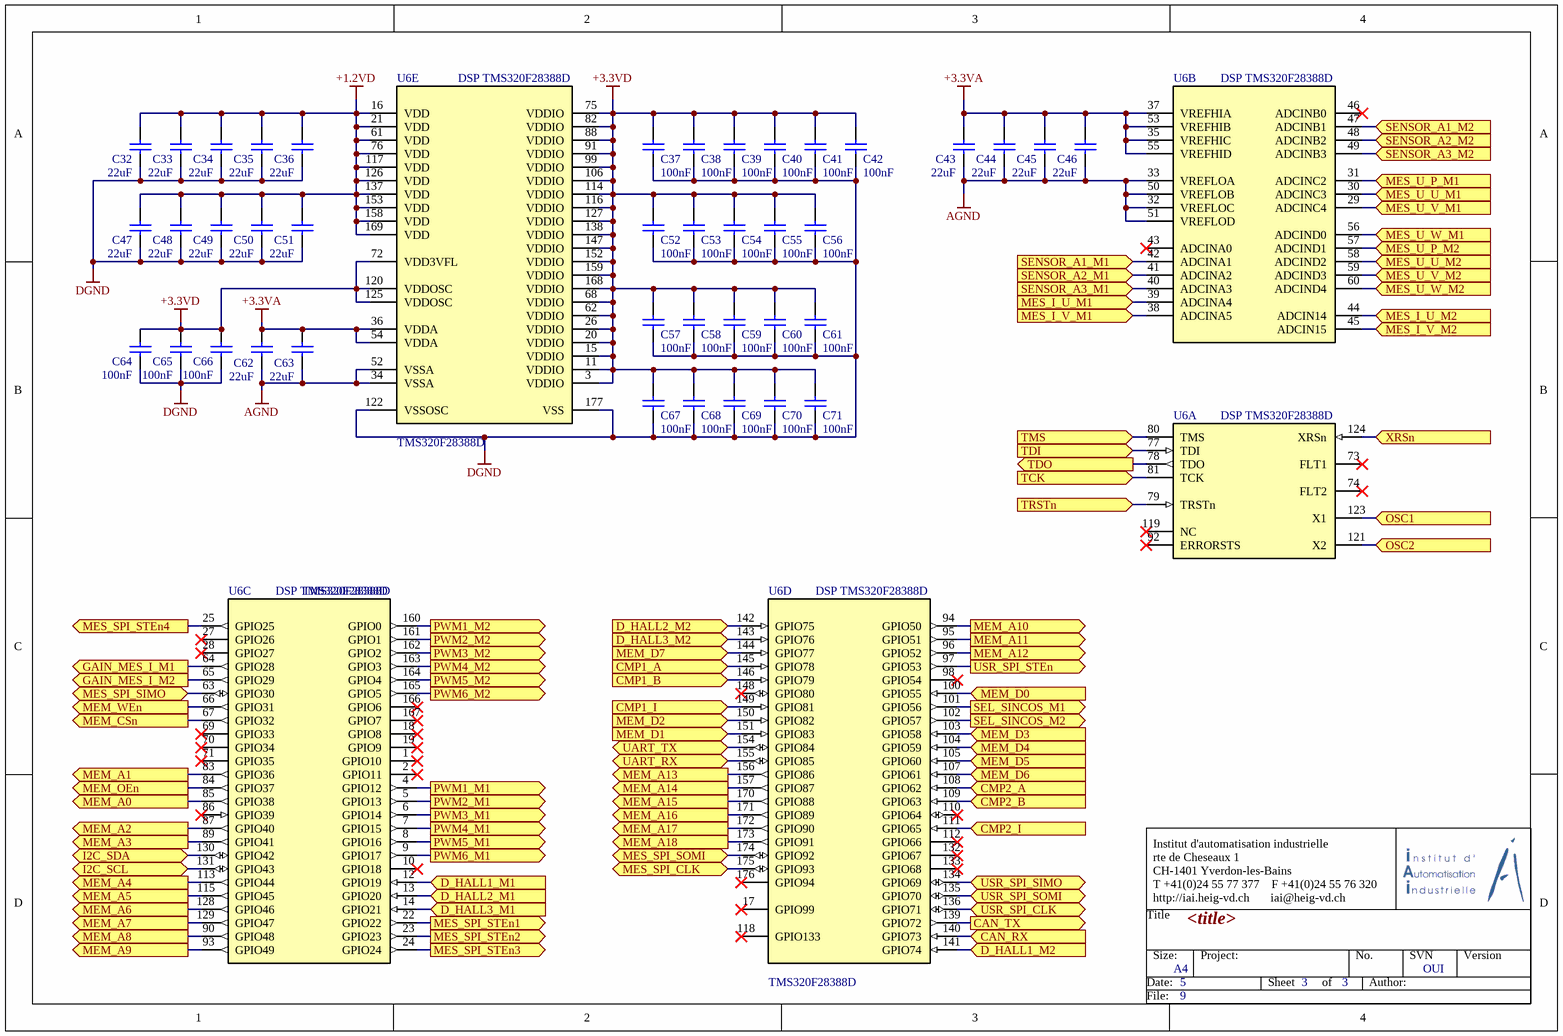
[diagram p2: DSP.SchDoc]

### Parts
C32  value 22uF  [CAPC1608X08N]  (hidden comment: CAP CER 22uF 0603)
C33  value 22uF  [CAPC1608X08N]  (hidden comment: CAP CER 22uF 0603)
C34  value 22uF  [CAPC1608X08N]  (hidden comment: CAP CER 22uF 0603)
C35  value 22uF  [CAPC1608X08N]  (hidden comment: CAP CER 22uF 0603)
C36  value 22uF  [CAPC1608X08N]  (hidden comment: CAP CER 22uF 0603)
C37  value 100nF  [CAPC1608X08N]  (hidden comment: CAP CER 100nF 0603)
C38  value 100nF  [CAPC1608X08N]  (hidden comment: CAP CER 100nF 0603)
C39  value 100nF  [CAPC1608X08N]  (hidden comment: CAP CER 100nF 0603)
C40  value 100nF  [CAPC1608X08N]  (hidden comment: CAP CER 100nF 0603)
C41  value 100nF  [CAPC1608X08N]  (hidden comment: CAP CER 100nF 0603)
C42  value 100nF  [CAPC1608X08N]  (hidden comment: CAP CER 100nF 0603)
C43  value 22uF  [CAPC1608X08N]  (hidden comment: CAP CER 22uF 0603)
C44  value 22uF  [CAPC1608X08N]  (hidden comment: CAP CER 22uF 0603)
C45  value 22uF  [CAPC1608X08N]  (hidden comment: CAP CER 22uF 0603)
C46  value 22uF  [CAPC1608X08N]  (hidden comment: CAP CER 22uF 0603)
C47  value 22uF  [CAPC1608X08N]  (hidden comment: CAP CER 22uF 0603)
C48  value 22uF  [CAPC1608X08N]  (hidden comment: CAP CER 22uF 0603)
C49  value 22uF  [CAPC1608X08N]  (hidden comment: CAP CER 22uF 0603)
C50  value 22uF  [CAPC1608X08N]  (hidden comment: CAP CER 22uF 0603)
C51  value 22uF  [CAPC1608X08N]  (hidden comment: CAP CER 22uF 0603)
C52  value 100nF  [CAPC1608X08N]  (hidden comment: CAP CER 100nF 0603)
C53  value 100nF  [CAPC1608X08N]  (hidden comment: CAP CER 100nF 0603)
C54  value 100nF  [CAPC1608X08N]  (hidden comment: CAP CER 100nF 0603)
C55  value 100nF  [CAPC1608X08N]  (hidden comment: CAP CER 100nF 0603)
C56  value 100nF  [CAPC1608X08N]  (hidden comment: CAP CER 100nF 0603)
C57  value 100nF  [CAPC1608X08N]  (hidden comment: CAP CER 100nF 0603)
C58  value 100nF  [CAPC1608X08N]  (hidden comment: CAP CER 100nF 0603)
C59  value 100nF  [CAPC1608X08N]  (hidden comment: CAP CER 100nF 0603)
C60  value 100nF  [CAPC1608X08N]  (hidden comment: CAP CER 100nF 0603)
C61  value 100nF  [CAPC1608X08N]  (hidden comment: CAP CER 100nF 0603)
C62  value 22uF  [CAPC1608X08N]  (hidden comment: CAP CER 22uF 0603)
C63  value 22uF  [CAPC1608X08N]  (hidden comment: CAP CER 22uF 0603)
C64  value 100nF  [CAPC1608X08N]  (hidden comment: CAP CER 100nF 0603)
C65  value 100nF  [CAPC1608X08N]  (hidden comment: CAP CER 100nF 0603)
C66  value 100nF  [CAPC1608X08N]  (hidden comment: CAP CER 100nF 0603)
C67  value 100nF  [CAPC1608X08N]  (hidden comment: CAP CER 100nF 0603)
C68  value 100nF  [CAPC1608X08N]  (hidden comment: CAP CER 100nF 0603)
C69  value 100nF  [CAPC1608X08N]  (hidden comment: CAP CER 100nF 0603)
C70  value 100nF  [CAPC1608X08N]  (hidden comment: CAP CER 100nF 0603)
C71  value 100nF  [CAPC1608X08N]  (hidden comment: CAP CER 100nF 0603)
U6  DSP TMS320F28388D  [TSQFP50P2600X2600X160_HS-177N]  (parts A,B,C,D,E of 5)

### Ports
CAN_RX (in), CAN_TX (out), CMP1_A (in), CMP1_B (in), CMP1_I (in), CMP2_A (in), CMP2_B (in), CMP2_I (in), D_HALL1_M1 (in), D_HALL1_M2 (in), D_HALL2_M1 (in), D_HALL2_M2 (in), D_HALL3_M1 (in), D_HALL3_M2 (in), GAIN_MES_I_M1 (out), GAIN_MES_I_M2 (out), I2C_SCL (bidir), I2C_SDA (bidir), MEM_A0 (out), MEM_A1 (out), MEM_A2 (out), MEM_A3 (out), MEM_A4 (out), MEM_A5 (out), MEM_A6 (out), MEM_A7 (out), MEM_A8 (out), MEM_A9 (out), MEM_A10 (out), MEM_A11 (out), MEM_A12 (out), MEM_A13 (out), MEM_A14 (out), MEM_A15 (out), MEM_A16 (out), MEM_A17 (out), MEM_A18 (out), MEM_CSn (out), MEM_D0 (in), MEM_D1 (in), MEM_D2 (in), MEM_D3 (in), MEM_D4 (in), MEM_D5 (in), MEM_D6 (in), MEM_D7 (in), MEM_OEn (out), MEM_WEn (out), MES_I_U_M1 (in), MES_I_U_M2 (in), MES_I_V_M1 (in), MES_I_V_M2 (in), MES_SPI_CLK (bidir), MES_SPI_SIMO (bidir), MES_SPI_SOMI (bidir), MES_SPI_STEn1 (out), MES_SPI_STEn2 (out), MES_SPI_STEn3 (out), MES_SPI_STEn4 (out), MES_U_P_M1 (in), MES_U_P_M2 (in), MES_U_U_M1 (in), MES_U_U_M2 (in), MES_U_V_M1 (in), MES_U_V_M2 (in), MES_U_W_M1 (in), MES_U_W_M2 (in), OSC1 (in), OSC2 (in), PWM1_M1 (out), PWM1_M2 (out), PWM2_M1 (out), PWM2_M2 (out), PWM3_M1 (out), PWM3_M2 (out), PWM4_M1 (out), PWM4_M2 (out), PWM5_M1 (out), PWM5_M2 (out), PWM6_M1 (out), PWM6_M2 (out), SEL_SINCOS_M1 (out), SEL_SINCOS_M2 (out), SENSOR_A1_M1 (in), SENSOR_A1_M2 (in), SENSOR_A2_M1 (in), SENSOR_A2_M2 (in), SENSOR_A3_M1 (in), SENSOR_A3_M2 (in), TCK (in), TDI (in), TDO (out), TMS (in), TRSTn (in), UART_RX (bidir), UART_TX (bidir), USR_SPI_CLK (bidir), USR_SPI_SIMO (bidir), USR_SPI_SOMI (bidir), USR_SPI_STEn (out), XRSn (in)

### Nets
+1.2VD: C32.2 C33.2 C34.2 C35.2 C36.2 C47.2 C48.2 C49.2 C50.2 C51.2 U6.16(VDD) U6.21(VDD) U6.61(VDD) U6.76(VDD) U6.117(VDD) U6.126(VDD) U6.137(VDD) U6.153(VDD) U6.158(VDD) U6.169(VDD)
+3.3VA: C43.2 C44.2 C45.2 C46.2 C62.2 C63.2 U6.35(VREFHIC) U6.36(VDDA) U6.37(VREFHIA) U6.53(VREFHIB) U6.54(VDDA) U6.55(VREFHID)
+3.3VD: C37.2 C38.2 C39.2 C40.2 C41.2 C42.2 C52.2 C53.2 C54.2 C55.2 C56.2 C57.2 C58.2 C59.2 C60.2 C61.2 C64.2 C65.2 C66.2 C67.2 C68.2 C69.2 C70.2 C71.2 U6.3(VDDIO) U6.11(VDDIO) U6.15(VDDIO) U6.20(VDDIO) U6.26(VDDIO) U6.62(VDDIO) U6.68(VDDIO) U6.72(VDD3VFL) U6.75(VDDIO) U6.82(VDDIO) U6.88(VDDIO) U6.91(VDDIO) U6.99(VDDIO) U6.106(VDDIO) U6.114(VDDIO) U6.116(VDDIO) U6.120(VDDOSC) U6.125(VDDOSC) U6.127(VDDIO) U6.138(VDDIO) U6.147(VDDIO) U6.152(VDDIO) U6.159(VDDIO) U6.168(VDDIO)
AGND: C43.1 C44.1 C45.1 C46.1 C62.1 C63.1 U6.32(VREFLOC) U6.33(VREFLOA) U6.34(VSSA) U6.50(VREFLOB) U6.51(VREFLOD) U6.52(VSSA)
DGND: C32.1 C33.1 C34.1 C35.1 C36.1 C37.1 C38.1 C39.1 C40.1 C41.1 C42.1 C47.1 C48.1 C49.1 C50.1 C51.1 C52.1 C53.1 C54.1 C55.1 C56.1 C57.1 C58.1 C59.1 C60.1 C61.1 C64.1 C65.1 C66.1 C67.1 C68.1 C69.1 C70.1 C71.1 U6.122(VSSOSC) U6.177(VSS)
A1: U6.31(ADCINC2) ; port MES_U_P_M1
A2: U6.30(ADCINC3) ; port MES_U_U_M1
A3: U6.29(ADCINC4) ; port MES_U_V_M1
A4: U6.56(ADCIND0) ; port MES_U_W_M1
A5: U6.39(ADCINA4) ; port MES_I_U_M1
A6: U6.38(ADCINA5) ; port MES_I_V_M1
A7: U6.42(ADCINA1) ; port SENSOR_A1_M1
A8: U6.41(ADCINA2) ; port SENSOR_A2_M1
A9: U6.40(ADCINA3) ; port SENSOR_A3_M1
A10: U6.57(ADCIND1) ; port MES_U_P_M2
A11: U6.58(ADCIND2) ; port MES_U_U_M2
A12: U6.59(ADCIND3) ; port MES_U_V_M2
A13: U6.60(ADCIND4) ; port MES_U_W_M2
A14: U6.44(ADCIN14) ; port MES_I_U_M2
A15: U6.45(ADCIN15) ; port MES_I_V_M2
A16: U6.47(ADCINB1) ; port SENSOR_A1_M2
A17: U6.48(ADCINB2) ; port SENSOR_A2_M2
A18: U6.49(ADCINB3) ; port SENSOR_A3_M2
D0: U6.100(GPIO55) ; port MEM_D0
D1: U6.151(GPIO83) ; port MEM_D1
D2: U6.150(GPIO82) ; port MEM_D2
D3: U6.103(GPIO58) ; port MEM_D3
D4: U6.104(GPIO59) ; port MEM_D4
D5: U6.105(GPIO60) ; port MEM_D5
D6: U6.107(GPIO61) ; port MEM_D6
D7: U6.144(GPIO77) ; port MEM_D7
OSC1: U6.123(X1) ; port OSC1
OSC2: U6.121(X2) ; port OSC2
TCK: U6.81(TCK) ; port TCK
TDI: U6.77(TDI) ; port TDI
TDO: U6.78(TDO) ; port TDO
TMS: U6.80(TMS) ; port TMS
TRSTn: U6.79(TRSTn) ; port TRSTn
XRSn: U6.124(XRSn) ; port XRSn
NetR1_1: U6.130(GPIO42) ; port I2C_SDA
NetR2_1: U6.131(GPIO43) ; port I2C_SCL
NetU4_1: U6.139(GPIO72) ; port CAN_TX
NetU4_4: U6.140(GPIO73) ; port CAN_RX
NetU6_4: U6.4(GPIO12) ; port PWM1_M1
NetU6_5: U6.5(GPIO13) ; port PWM2_M1
NetU6_6: U6.6(GPIO14) ; port PWM3_M1
NetU6_7: U6.7(GPIO15) ; port PWM4_M1
NetU6_8: U6.8(GPIO16) ; port PWM5_M1
NetU6_9: U6.9(GPIO17) ; port PWM6_M1
NetU6_12: U6.12(GPIO19) ; port D_HALL1_M1
NetU6_13: U6.13(GPIO20) ; port D_HALL2_M1
NetU6_14: U6.14(GPIO21) ; port D_HALL3_M1
NetU6_22: U6.22(GPIO22) ; port MES_SPI_STEn1
NetU6_23: U6.23(GPIO23) ; port MES_SPI_STEn2
NetU6_24: U6.24(GPIO24) ; port MES_SPI_STEn3
NetU6_25: U6.25(GPIO25) ; port MES_SPI_STEn4
NetU6_63: U6.63(GPIO30) ; port MES_SPI_SIMO
NetU6_64: U6.64(GPIO28) ; port GAIN_MES_I_M1
NetU6_65: U6.65(GPIO29) ; port GAIN_MES_I_M2
NetU6_66: U6.66(GPIO31) ; port MEM_WEn
NetU6_67: U6.67(GPIO32) ; port MEM_CSn
NetU6_83: U6.83(GPIO36) ; port MEM_A1
NetU6_84: U6.84(GPIO37) ; port MEM_OEn
NetU6_85: U6.85(GPIO38) ; port MEM_A0
NetU6_87: U6.87(GPIO40) ; port MEM_A2
NetU6_89: U6.89(GPIO41) ; port MEM_A3
NetU6_90: U6.90(GPIO48) ; port MEM_A8
NetU6_93: U6.93(GPIO49) ; port MEM_A9
NetU6_94: U6.94(GPIO50) ; port MEM_A10
NetU6_95: U6.95(GPIO51) ; port MEM_A11
NetU6_96: U6.96(GPIO52) ; port MEM_A12
NetU6_97: U6.97(GPIO53) ; port USR_SPI_STEn
NetU6_101: U6.101(GPIO56) ; port SEL_SINCOS_M1
NetU6_102: U6.102(GPIO57) ; port SEL_SINCOS_M2
NetU6_108: U6.108(GPIO62) ; port CMP2_A
NetU6_109: U6.109(GPIO63) ; port CMP2_B
NetU6_111: U6.111(GPIO65) ; port CMP2_I
NetU6_113: U6.113(GPIO44) ; port MEM_A4
NetU6_115: U6.115(GPIO45) ; port MEM_A5
NetU6_128: U6.128(GPIO46) ; port MEM_A6
NetU6_129: U6.129(GPIO47) ; port MEM_A7
NetU6_134: U6.134(GPIO69) ; port USR_SPI_SIMO
NetU6_135: U6.135(GPIO70) ; port USR_SPI_SOMI
NetU6_136: U6.136(GPIO71) ; port USR_SPI_CLK
NetU6_141: U6.141(GPIO74) ; port D_HALL1_M2
NetU6_142: U6.142(GPIO75) ; port D_HALL2_M2
NetU6_143: U6.143(GPIO76) ; port D_HALL3_M2
NetU6_145: U6.145(GPIO78) ; port CMP1_A
NetU6_146: U6.146(GPIO79) ; port CMP1_B
NetU6_149: U6.149(GPIO81) ; port CMP1_I
NetU6_154: U6.154(GPIO84) ; port UART_TX
NetU6_155: U6.155(GPIO85) ; port UART_RX
NetU6_156: U6.156(GPIO86) ; port MEM_A13
NetU6_157: U6.157(GPIO87) ; port MEM_A14
NetU6_160: U6.160(GPIO0) ; port PWM1_M2
NetU6_161: U6.161(GPIO1) ; port PWM2_M2
NetU6_162: U6.162(GPIO2) ; port PWM3_M2
NetU6_163: U6.163(GPIO3) ; port PWM4_M2
NetU6_164: U6.164(GPIO4) ; port PWM5_M2
NetU6_165: U6.165(GPIO5) ; port PWM6_M2
NetU6_170: U6.170(GPIO88) ; port MEM_A15
NetU6_171: U6.171(GPIO89) ; port MEM_A16
NetU6_172: U6.172(GPIO90) ; port MEM_A17
NetU6_173: U6.173(GPIO91) ; port MEM_A18
NetU6_174: U6.174(GPIO92) ; port MES_SPI_SOMI
NetU6_175: U6.175(GPIO93) ; port MES_SPI_CLK

Not connected (* = marked no-connect by the designer): U6 1(GPIO10)* 2(GPIO11)* 10(GPIO18)* 17(GPIO99)* 18(GPIO8)* 19(GPIO9)* 27(GPIO26)* 28(GPIO27)* 43(ADCINA0)* 46(ADCINB0)* 69(GPIO33)* 70(GPIO34)* 71(GPIO35)* 73(FLT1)* 74(FLT2)* 86(GPIO39)* 92(ERRORSTS)* 98(GPIO54)* 110(GPIO64)* 112(GPIO66)* 118(GPIO133)* 119(NC)* 132(GPIO67)* 133(GPIO68)* 148(GPIO80)* 166(GPIO6)* 167(GPIO7)* 176(GPIO94)*

### Notes on the sheet
- Title
- Institut d'automatisation industrielle
  rte de Cheseaux 1
  CH-1401 Yverdon-les-Bains
  T +41(0)24 55 77 377    F +41(0)24 55 76 320
  http://iai.heig-vd.ch       iai@heig-vd.ch
- Date:
- Size:
- A4
- Project:
- Sheet
- of
- No.
- Author:
- SVN
- Version
- File:

### Library data of the parts
C32-C36 C43-C51 C62 C63 = CAP CER 22uF 20% 6V3 0603: 22µF ±20% 6,3V Condensateurs céramique X5R 0603 (1608 métrique); Supplier 1: Digi-Key; Supplier Part Number 1: 399-14498-1-ND
C37-C42 C52-C61 C64-C71 = CAP CER 100nF 10% 10V 0603: as C11 on sheet FunctionalSchematic; Supplier 1: Digi-Key; Supplier Part Number 1: 399-1095-1-ND
U6 = DSP TMS320F28388D: Microcontrôleurs ARM - MCU C2000 32-bit MCU w/ connectivity manager, 2x C28x+CLA CPU, 1.5-MB flash, FPU64, CLB, ENET, EtherCAT 176-HLQFP -40 to 125 °C; Value: TMS320F28388D

## Nets that join several sheets
+1.2VD: FunctionalSchematic (C6.2 U2.5 U2.6 U2.12), DSP (20 pins)
+3.3VA: FunctionalSchematic (L1.2), DSP (12 pins)
+3.3VD: CommandBoard (8 pins), FunctionalSchematic (12 pins), DSP (48 pins)
+5VD: CommandBoard (8 pins), FunctionalSchematic (8 pins)
+12V: CommandBoard (X1.3 X4.3), FunctionalSchematic (C9.2 U3.4)
AGND: CommandBoard (X1.6 X4.6), FunctionalSchematic (21 pins), DSP (12 pins)
DGND: CommandBoard (10 pins), FunctionalSchematic (29 pins), DSP (36 pins)
GND_12V: CommandBoard (X1.8 X4.8), FunctionalSchematic (C9.1 C10.2 U3.3)
A1: FunctionalSchematic (C14.2 R10.2), DSP (U6.31)
A2: FunctionalSchematic (C20.2 R16.2), DSP (U6.30)
A3: FunctionalSchematic (C26.2 R22.2), DSP (U6.29)
A4: FunctionalSchematic (C15.2 R11.2), DSP (U6.56)
A5: FunctionalSchematic (C21.2 R17.2), DSP (U6.39)
A6: FunctionalSchematic (C27.2 R23.2), DSP (U6.38)
A7: FunctionalSchematic (C16.2 R12.2), DSP (U6.42)
A8: FunctionalSchematic (C22.2 R18.2), DSP (U6.41)
A9: FunctionalSchematic (C28.2 R24.2), DSP (U6.40)
A10: FunctionalSchematic (C17.2 R13.2), DSP (U6.57)
A11: FunctionalSchematic (C23.2 R19.2), DSP (U6.58)
A12: FunctionalSchematic (C29.2 R25.2), DSP (U6.59)
A13: FunctionalSchematic (C18.2 R14.2), DSP (U6.60)
A14: FunctionalSchematic (C24.2 R20.2), DSP (U6.44)
A15: FunctionalSchematic (C30.2 R26.2), DSP (U6.45)
A16: FunctionalSchematic (C19.2 R15.2), DSP (U6.47)
A17: FunctionalSchematic (C25.2 R21.2), DSP (U6.48)
A18: FunctionalSchematic (C31.2 R27.2), DSP (U6.49)
D0: FunctionalSchematic (U8.13), DSP (U6.100)
D1: FunctionalSchematic (U8.14), DSP (U6.151)
D2: FunctionalSchematic (U8.15), DSP (U6.150)
D3: FunctionalSchematic (U8.17), DSP (U6.103)
D4: FunctionalSchematic (U8.18), DSP (U6.104)
D5: FunctionalSchematic (U8.19), DSP (U6.105)
D6: FunctionalSchematic (U8.20), DSP (U6.107)
D7: FunctionalSchematic (U8.21), DSP (U6.144)
NetJP1_1: CommandBoard (X11.2), FunctionalSchematic (JP1.1 U4.7)
NetR1_1: CommandBoard (R1.1 X9.3), DSP (U6.130)
NetR2_1: CommandBoard (R2.1 X9.2), DSP (U6.131)
NetR9_1: CommandBoard (X11.3), FunctionalSchematic (R9.1 U4.6)
NetR10_1: CommandBoard (X2.1), FunctionalSchematic (R10.1)
NetR11_1: CommandBoard (X2.4), FunctionalSchematic (R11.1)
NetR12_1: CommandBoard (X6.12), FunctionalSchematic (R12.1)
NetR13_1: CommandBoard (X3.1), FunctionalSchematic (R13.1)
NetR14_1: CommandBoard (X3.4), FunctionalSchematic (R14.1)
NetR15_1: CommandBoard (X10.12), FunctionalSchematic (R15.1)
NetR16_1: CommandBoard (X2.2), FunctionalSchematic (R16.1)
NetR17_1: CommandBoard (X2.5), FunctionalSchematic (R17.1)
NetR18_1: CommandBoard (X6.13), FunctionalSchematic (R18.1)
NetR19_1: CommandBoard (X3.2), FunctionalSchematic (R19.1)
NetR20_1: CommandBoard (X3.5), FunctionalSchematic (R20.1)
NetR21_1: CommandBoard (X10.13), FunctionalSchematic (R21.1)
NetR22_1: CommandBoard (X2.3), FunctionalSchematic (R22.1)
NetR23_1: CommandBoard (X2.6), FunctionalSchematic (R23.1)
NetR24_1: CommandBoard (X6.14), FunctionalSchematic (R24.1)
NetR25_1: CommandBoard (X3.3), FunctionalSchematic (R25.1)
NetR26_1: CommandBoard (X3.6), FunctionalSchematic (R26.1)
NetR27_1: CommandBoard (X10.14), FunctionalSchematic (R27.1)
NetU4_1: FunctionalSchematic (U4.1), DSP (U6.139)
NetU4_4: FunctionalSchematic (U4.4), DSP (U6.140)
NetU4_5: CommandBoard (X11.1), FunctionalSchematic (U4.5)
NetU6_4: CommandBoard (X1.9), DSP (U6.4)
NetU6_5: CommandBoard (X1.10), DSP (U6.5)
NetU6_6: CommandBoard (X1.11), DSP (U6.6)
NetU6_7: CommandBoard (X1.12), DSP (U6.7)
NetU6_8: CommandBoard (X1.13), DSP (U6.8)
NetU6_9: CommandBoard (X1.14), DSP (U6.9)
NetU6_12: CommandBoard (X6.1), DSP (U6.12)
NetU6_13: CommandBoard (X6.2), DSP (U6.13)
NetU6_14: CommandBoard (X6.3), DSP (U6.14)
NetU6_22: CommandBoard (X2.10), DSP (U6.22)
NetU6_23: CommandBoard (X6.11), DSP (U6.23)
NetU6_24: CommandBoard (X3.10), DSP (U6.24)
NetU6_25: CommandBoard (X10.11), DSP (U6.25)
NetU6_63: CommandBoard (X2.7 X3.7), DSP (U6.63)
NetU6_64: CommandBoard (X1.15), DSP (U6.64)
NetU6_65: CommandBoard (X4.15), DSP (U6.65)
NetU6_66: FunctionalSchematic (U8.29), DSP (U6.66)
NetU6_67: FunctionalSchematic (U8.22), DSP (U6.67)
NetU6_83: FunctionalSchematic (U8.11), DSP (U6.83)
NetU6_84: FunctionalSchematic (U8.24), DSP (U6.84)
NetU6_85: FunctionalSchematic (U8.12), DSP (U6.85)
NetU6_87: FunctionalSchematic (U8.10), DSP (U6.87)
NetU6_89: FunctionalSchematic (U8.9), DSP (U6.89)
NetU6_90: FunctionalSchematic (U8.27), DSP (U6.90)
NetU6_93: FunctionalSchematic (U8.26), DSP (U6.93)
NetU6_94: FunctionalSchematic (U8.23), DSP (U6.94)
NetU6_95: FunctionalSchematic (U8.25), DSP (U6.95)
NetU6_96: FunctionalSchematic (U8.4), DSP (U6.96)
NetU6_97: CommandBoard (X14.4), DSP (U6.97)
NetU6_101: CommandBoard (X6.7), DSP (U6.101)
NetU6_102: CommandBoard (X10.7), DSP (U6.102)
NetU6_108: CommandBoard (X10.4), DSP (U6.108)
NetU6_109: CommandBoard (X10.5), DSP (U6.109)
NetU6_111: CommandBoard (X10.6), DSP (U6.111)
NetU6_113: FunctionalSchematic (U8.8), DSP (U6.113)
NetU6_115: FunctionalSchematic (U8.7), DSP (U6.115)
NetU6_128: FunctionalSchematic (U8.6), DSP (U6.128)
NetU6_129: FunctionalSchematic (U8.5), DSP (U6.129)
NetU6_134: CommandBoard (X14.1), DSP (U6.134)
NetU6_135: CommandBoard (X14.2), DSP (U6.135)
NetU6_136: CommandBoard (X14.3), DSP (U6.136)
NetU6_141: CommandBoard (X10.1), DSP (U6.141)
NetU6_142: CommandBoard (X10.2), DSP (U6.142)
NetU6_143: CommandBoard (X10.3), DSP (U6.143)
NetU6_145: CommandBoard (X6.4), DSP (U6.145)
NetU6_146: CommandBoard (X6.5), DSP (U6.146)
NetU6_149: CommandBoard (X6.6), DSP (U6.149)
NetU6_154: CommandBoard (X13.2), DSP (U6.154)
NetU6_155: CommandBoard (X13.1), DSP (U6.155)
NetU6_156: FunctionalSchematic (U8.28), DSP (U6.156)
NetU6_157: FunctionalSchematic (U8.3), DSP (U6.157)
NetU6_160: CommandBoard (X4.9), DSP (U6.160)
NetU6_161: CommandBoard (X4.10), DSP (U6.161)
NetU6_162: CommandBoard (X4.11), DSP (U6.162)
NetU6_163: CommandBoard (X4.12), DSP (U6.163)
NetU6_164: CommandBoard (X4.13), DSP (U6.164)
NetU6_165: CommandBoard (X4.14), DSP (U6.165)
NetU6_170: FunctionalSchematic (U8.31), DSP (U6.170)
NetU6_171: FunctionalSchematic (U8.2), DSP (U6.171)
NetU6_172: FunctionalSchematic (U8.30), DSP (U6.172)
NetU6_173: FunctionalSchematic (U8.1), DSP (U6.173)
NetU6_174: CommandBoard (X2.8 X3.8 X6.9 X10.9), DSP (U6.174)
NetU6_175: CommandBoard (X2.9 X3.9 X6.10 X10.10), DSP (U6.175)
OSC1: FunctionalSchematic (C13.1 XTAL1.1), DSP (U6.123)
OSC2: FunctionalSchematic (C12.2 XTAL1.3), DSP (U6.121)
TCK: FunctionalSchematic (X15.9 X15.11), DSP (U6.81)
TDI: FunctionalSchematic (X15.3), DSP (U6.77)
TDO: FunctionalSchematic (X15.7), DSP (U6.78)
TMS: FunctionalSchematic (X15.1), DSP (U6.80)
TRSTn: FunctionalSchematic (R7.2 X15.2), DSP (U6.79)
XRSn: FunctionalSchematic (U5.1), DSP (U6.124)